# EAGLE design ECL_balanced_pulser (EAGLE 6.5.0)
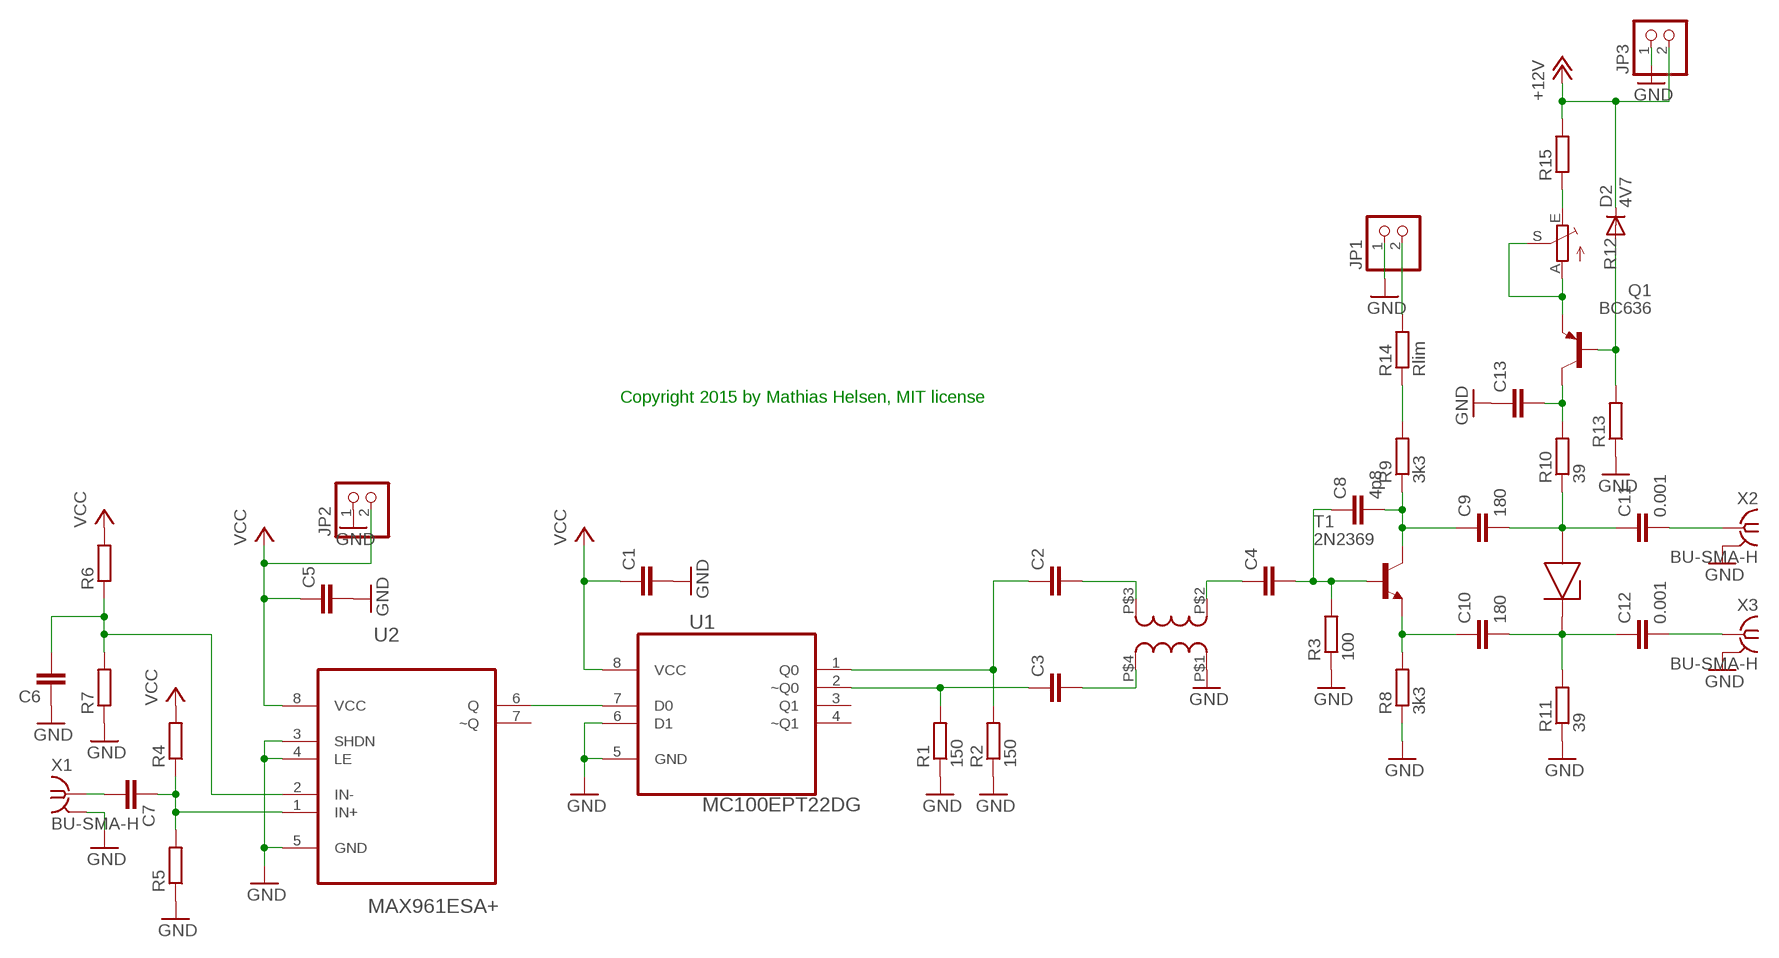
[diagram p0: schematic, sheet 1]

## Parts
C1  C-EUC0805  [C0805]
C2  C-EUC0805  [C0805]
C3  C-EUC0805  [C0805]
C4  C-EUC0805  [C0805]
C5  C-EUC0805  [C0805]
C6  C-EUC0805  [C0805]
C7  C-EUC0805  [C0805]
C8  4p8  C-EUC0805  [C0805]
C9  180  C-EUC0805  [C0805]
C10  180  C-EUC0805  [C0805]
C11  0.001  C-EUC0805  [C0805]
C12  0.001  C-EUC0805  [C0805]
C13  C-EUC0805  [C0805]
D2  4V7  1N4148DO35-7  [DO35-7]
JP1  PINHD-1X2  [1X02]
JP2  PINHD-1X2  [1X02]
JP3  PINHD-1X2  [1X02]
Q1  BC636  [TO92-BCE]
R1  150  R-EU_R0805  [R0805]
R2  150  R-EU_R0805  [R0805]
R3  100  R-EU_R0805  [R0805]
R4  R-EU_M0805  [M0805]
R5  R-EU_M0805  [M0805]
R6  R-EU_M0805  [M0805]
R7  R-EU_M0805  [M0805]
R8  3k3  R-EU_R0805  [R0805]
R9  3k3  R-EU_R0805  [R0805]
R10  39  R-EU_R0805  [R0805]
R11  39  R-EU_R0805  [R0805]
R12  TRIM_EU-SP19L  [SP19L]
R13  R-EU_R0805  [R0805]
R14  Rlim  R-EU_R0805  [R0805]
R15  R-EU_R0805  [R0805]
T1  2N2369  [TO18]
U1  MC100EPT22DG  [SOIC127P600X175-8N]
U2  MAX961ESA+  [SOIC127P600X175-8N]
U$1  JA4220  [T]
U$2  2D524A  [2D524A]
X1  BU-SMA-H  [BU-SMA-H]
X2  BU-SMA-H  [BU-SMA-H]
X3  BU-SMA-H  [BU-SMA-H]

## Nets
+12V: D2.C JP3.2 R15.2
GND: C1.2 C5.2 C6.1 C13.1 JP1.1 JP2.1 JP3.1 R1.1 R2.1 R3.1 R5.1 R7.1 R8.1 R11.1 R13.1 U1.5(GND) U1.6(D1) U2.3(SHDN) U2.4(LE) U2.5(GND) U$1.P$1 X1.2 X1.3 X1.4 X1.5 X2.2 X2.3 X2.4 X2.5 X3.2 X3.3 X3.4 X3.5
N$1: U1.7(D0) U2.6(Q)
N$2: C3.1 R1.2 U1.2(~Q0)
N$3: C2.1 R2.2 U1.1(Q0)
N$4: C2.2 U$1.P$3
N$5: C3.2 U$1.P$4
N$6: C4.1 U$1.P$2
N$7: C4.2 C8.1 R3.2 T1.2(B)
N$8: C7.2 X1.1
N$9: C7.1 R4.1 R5.2 U2.1(IN+)
N$10: C6.2 R6.1 R7.2 U2.2(IN-)
N$11: C8.2 C9.1 R9.1 T1.3(C)
N$12: C10.1 R8.2 T1.1(E)
N$13: JP1.2 R14.2
N$14: C9.2 C11.1 R10.1 U$2.ANODE
N$15: C11.2 X2.1
N$16: C10.2 C12.1 R11.2 U$2.CATHODE
N$17: C12.2 X3.1
N$18: C13.2 Q1.C R10.2
N$19: R9.2 R14.1
N$20: Q1.E R12.A R12.S
N$21: D2.A Q1.B R13.2
N$22: R12.E R15.1
VCC: C1.1 C5.1 JP2.2 R4.2 R6.2 U1.8(VCC) U2.8(VCC)
Unconnected: U1.3(Q1) U1.4(~Q1) U2.7(~Q)

## Notes on the sheet
- Copyright 2015 by Mathias Helsen, MIT license

## Library data of the parts
C1-C13 = resistor:C-EU: CAPACITOR, European symbol
D2 = diode:1N4148: DIODE high speed (Philips)
JP1-JP3 = pinhead:PINHD-1X2: PIN HEADER
Q1 = transistor-pnp:BC636*: PNP Transistror
R1-R11 R13-R15 = resistor:R-EU_: RESISTOR, European symbol
R12 = pot:TRIM_EU-: POTENTIOMETER
T1 = transistor-neu-to92:2N2369: NPN TRANSISTOR
U1 = MC100EPT22:MC100EPT22DG: 3.3VDual LVTTL/LVCMOS to Differential LVPECL Translator; MPN: MC100EPT22DG; OC_FARNELL: 1607867; OC_NEWARK: 45J0924; PACKAGE: SOIC-8; SUPPLIER: Onsemiconductor
U2 = MAX961:MAX961ESA+: Single/Dual/Quad, Ultra-High-Speed, +3V/+5V, Beyond-the-Rails Comparators; MPN: MAX961ESA+; OC_FARNELL: 9725806; OC_NEWARK: 68K5085; PACKAGE: SOIC-8; SUPPLIER: Maxim
U$1 = \cct:JA4220
U$2 = srd:2D524A
X1-X3 = con-coax:BU-SMA-H: FEMALE SMA CONNECTOR Radiall; OC_FARNELL: unknown; OC_NEWARK: unknown

## Board
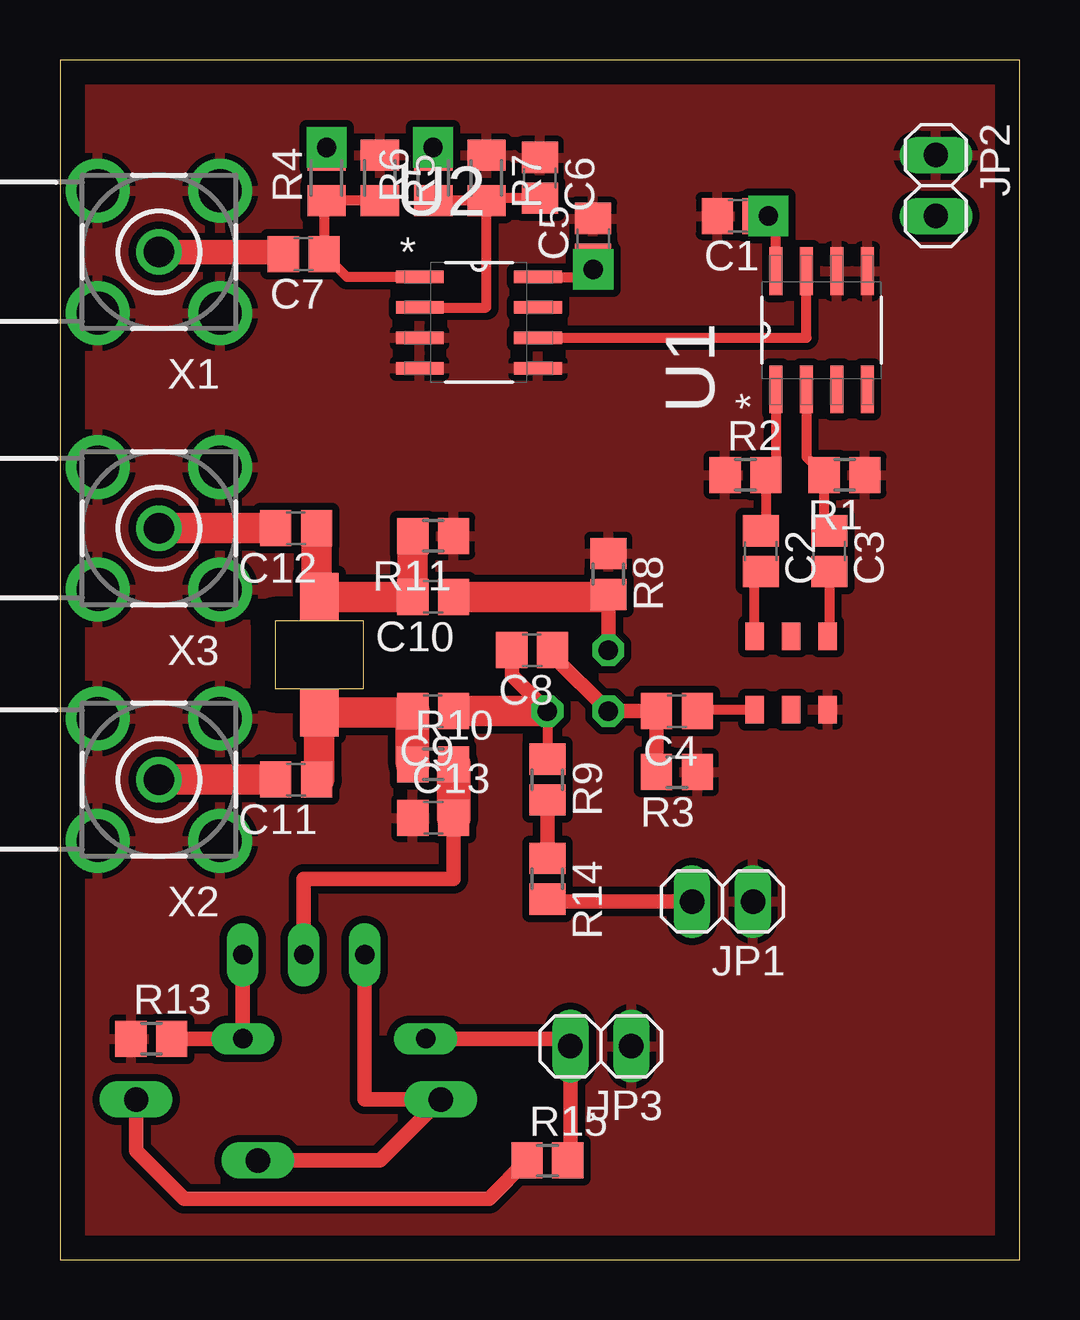
[diagram p1: board, top side]
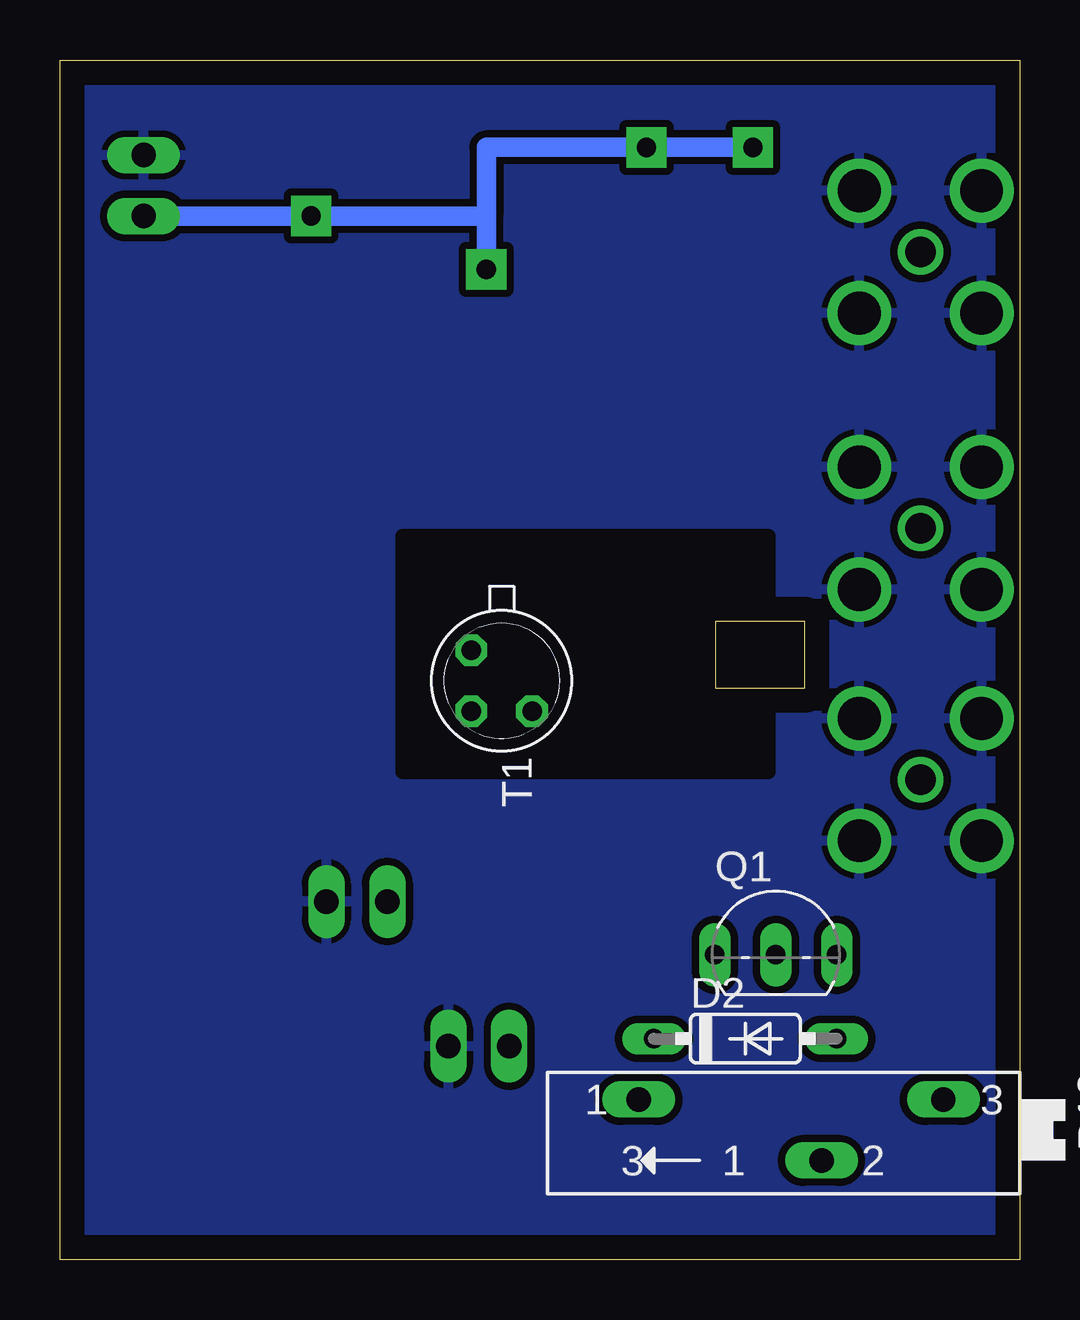
[diagram p2: board, bottom side, seen from below]

Size 40 x 50 mm. Coordinates in mm from the lower left corner, seen from the top.
Outline: 0,0 40,0 40,50 0,50 0,0
Copper layers (1*16): Top 0.035mm / dielectric 1.5mm / Bottom 0.035mm
Design rules "default": minimum track width 10mil, minimum drill 24mil, track to track 8mil, track to pad 8mil, pad to pad 8mil, via to via 8mil, smd to smd 8mil, copper to edge 40mil, drill to drill 8mil, minimum pad ring 10mil, minimum via ring 8mil, stop-mask expansion 4mil, vias tented up to drill 0mil, thermal gap 10mil
bRestrict: area 10.5,20.3 to 25.7,30.2

### Footprints (pad centres in the part's own frame; a part is rotated, then mirrored left to right if it is on the bottom)
C0805 = smd 1.3 x 1.5: 1 -0.85,0; 2 0.85,0
DO35-7 = drill 0.813 long: A 3.81,0; C -3.81,0
1X02 = drill 1.016 long: 1 -1.27,0; 2 1.27,0
TO92-BCE = drill 0.813 long: B 2.54,0; C 0,0; E -2.54,0
R0805 = smd 1.3 x 1.5: 1 -0.85,0; 2 0.85,0
M0805 = smd 1.3 x 1.6: 1 -0.95,0; 2 0.95,0
SP19L = drill 1.016 long: A 5.715,-1.27; E -6.985,-1.27; S -1.905,1.27
TO18 = drill 0.813 octagon: 1 -1.27,-1.27; 2 1.27,-1.27; 3 1.27,1.27
SOIC127P600X175-8N = smd 1.981 x 0.559: 1 -2.464,1.905; 2 -2.464,0.635; 3 -2.464,-0.635; 4 -2.464,-1.905; 5 2.464,-1.905; 6 2.464,-0.635; 7 2.464,0.635; 8 2.464,1.905
SOIC127P600X175-8N' = smd 1.981 x 0.533: 1 -2.464,1.905; 2 -2.464,0.635; 3 -2.464,-0.635; 4 -2.464,-1.905; 5 2.464,-1.905; 6 2.464,-0.635; 7 2.464,0.635; 8 2.464,1.905
T = smd 0.762 x 1.143: P$1 -1.524,1.524; P$2 1.524,1.524; P$3 1.524,-1.524; P$4 -1.524,-1.524; P$5 0,1.524; P$6 0,-1.524
2D524A = smd 2 x 1.6: ANODE -2.4,0; CATHODE 2.4,0
BU-SMA-H = drill 1.27: 1 0,0 | drill 1.778: 2 -2.55,2.55; 3 2.55,2.55; 4 2.55,-2.55; 5 -2.55,-2.55

### Placement (x,y rotation side)
C1  28.26,43.5 180 top
C2  29.21,29.53 270 top
C3  32.07,29.53 270 top
C4  25.72,22.86 180 top
C5  22.23,42.55 90 top
C6  20,45.09 270 top
C7  10.16,41.91 180 top
C8  19.68,25.4 180 top
C9  15.56,22.86 180 top
C10  15.56,27.62 180 top
C11  9.84,20 180 top
C12  9.84,30.48 180 top
C13  15.56,18.41 0 top
D2  11.43,9.21 0 bottom
JP1  27.62,14.92 180 top
JP2  36.51,44.77 270 top
JP3  22.54,8.89 180 top
Q1  10.16,12.7 0 bottom
R1  32.7,32.7 180 top
R2  28.57,32.7 0 top
R3  25.72,20.32 180 top
R4  11.11,45.09 90 top
R5  13.34,45.09 270 top
R6  15.56,45.09 90 top
R7  17.78,45.09 270 top
R8  22.86,28.57 270 top
R9  20.32,20 270 top
R10  15.56,20.64 0 top
R11  15.56,30.16 180 top
R12  10.16,5.4 180 bottom
R13  3.81,9.21 0 top
R14  20.32,15.88 270 top
R15  20.32,4.13 0 top
T1  21.59,24.13 270 bottom
U1  31.75,38.73 90 top
U2  MAX961ESA+  [SOIC127P600X175-8N']  17.46,39.05 0 top
U$1  30.48,24.45 180 top
U$2  10.81,25.21 90 top
X1  4.13,42 180 top
X2  4.13,20 180 top
X3  4.13,30.48 180 top

### Tracks (layer width: path | path; a pad name or v marks a point on that pad's centre or on a via)
+12V
  Top 0.61: R15.2 arc90 21.27,4.23 JP3.2 21.27,9.21 D2.C
GND
  pour Top (isolate 0.305): 0,0 41.1,0 40.79,50.55 0,50.55
  pour Bottom (isolate 0.305): 41.1,0 0,0 0,50.55 40.79,50.55
N$1
  Top 0.406: U2.6 31.11,38.42 U1.7
N$2
  Top 0.406: C3.1 31.85,30.59 R1.2 31.11,33.44 U1.2
N$3
  Top 0.406: C2.1 29.43,30.59 R2.2 29.84,33.12 U1.1
N$4
  Top 0.406: U$1.P$3 28.96,28.42 C2.2
N$5
  Top 0.406: C3.2 32.07,26.04 U$1.P$4
N$6
  Top 0.406: C4.1 26.57,22.92 U$1.P$2
N$7
  Top 0.406: C8.1 20.54,25.18
  Top 0.61: R3.2 C4.2 T1.2 20.54,25.18
N$8
  Top 1.016: X1.1 9.22,42 C7.2
N$9
  Top 0.406: R5.2 R4.1 11.01,44.13 C7.1 11.96,40.96 U2.1
N$10
  Top 0.406: C6.2 17.78,44.23 R7.2 | R7.2 R6.1 | U2.2 17.78,39.69 R7.2
N$11
  Top 0.406: T1.3 R9.1
  Top 0.61: T1.3 18.84,24.34 C8.2
  Top 1.27: C9.1 T1.3
N$12
  Top 0.61: R8.2 T1.1
  Top 1.27: C10.1 22.86,27.62 R8.2
N$13
  Top 0.61: JP1.2 20.32,14.92 R14.2
  Top 1.27: JP1.2 26.35,15.03
N$14
  Top 1.27: C11.1 10.81,20 U$2.ANODE 14.71,22.81 C9.2
  Top 1.422: R10.1 C9.2
N$15
  Top 1.27: X2.1 C11.2
N$16
  Top 1.27: R11.2 C10.2 10.81,27.62 U$2.CATHODE 10.69,27.61 C12.1
N$17
  Top 1.27: X3.1 C12.2
N$18
  Top 0.61: C13.2 16.41,15.88 10.16,15.88 Q1.C
  Top 1.422: R10.2 C13.2
N$19
  Top 0.61: R9.2 R14.1
N$20
  Top 0.61: R12.S 13.34,4.13 R12.A 12.7,6.67 Q1.E
N$21
  Top 0.61: Q1.B D2.A R13.2
N$22
  Top 0.61: R12.E 3.17,4.54 5.17,2.54 17.88,2.54 R15.1
VCC  (via drill 0.8 pad 1.68)
  Top 0.406: U2.8 22.23,40.96 v22.23,41.27 C5.1 | U1.8 29.84,43.18 v29.53,43.5
  Top 0.813: v11.11,46.35 R4.2 | v15.56,46.35 R6.2 | v29.53,43.5 C1.1
  Bottom 0.813: v11.11,46.35 v15.56,46.35 22.23,46.35 22.23,43.5 | v22.23,41.27 22.23,43.5 | 22.23,43.5 v29.53,43.5 JP2.2

### Text on the board
tDocu: Copyright 2015 by Mathias Helsen, MIT license